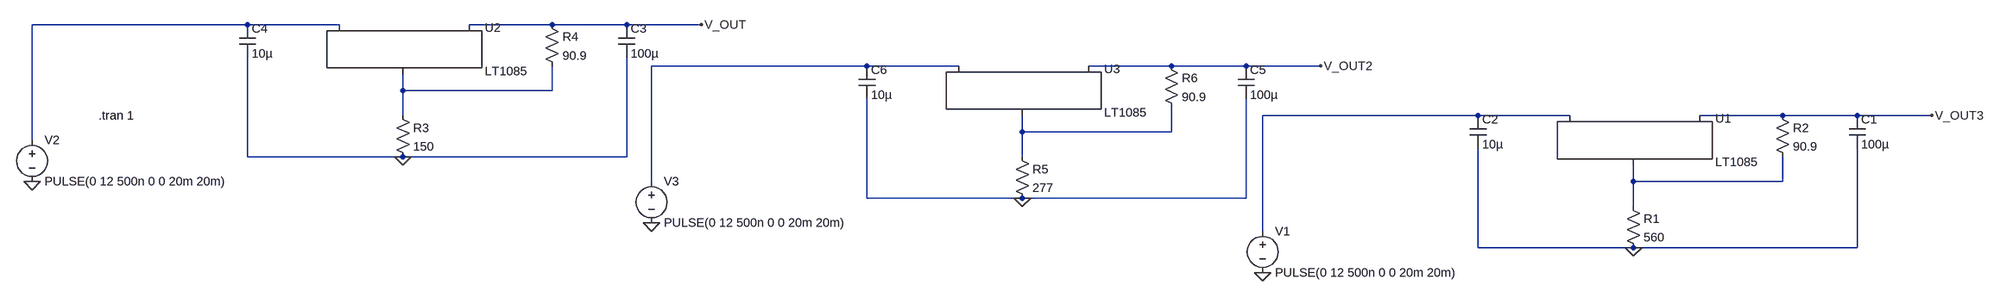
[diagram p0: schematic Component_Voltage_Generation_LT_Spice_Schematic.asc]
Component_Voltage_Generation_LT_Spice_Schematic.asc, the LTspice schematic file:
Version 4
SHEET 1 1040 820
WIRE -3072 80 -3488 80
WIRE -2880 80 -3072 80
WIRE -2464 80 -2624 80
WIRE -2320 80 -2464 80
WIRE -2176 80 -2320 80
WIRE -1856 160 -2272 160
WIRE -1664 160 -1856 160
WIRE -1248 160 -1408 160
WIRE -1104 160 -1248 160
WIRE -960 160 -1104 160
WIRE -2752 208 -2752 176
WIRE -2464 208 -2464 160
WIRE -2464 208 -2752 208
WIRE -2752 256 -2752 208
WIRE -656 256 -1072 256
WIRE -464 256 -656 256
WIRE -48 256 -208 256
WIRE 96 256 -48 256
WIRE 240 256 96 256
WIRE -1536 288 -1536 256
WIRE -1248 288 -1248 240
WIRE -1248 288 -1536 288
WIRE -3488 304 -3488 80
WIRE -3072 336 -3072 144
WIRE -2752 336 -3072 336
WIRE -2320 336 -2320 144
WIRE -2320 336 -2752 336
WIRE -1536 336 -1536 288
WIRE -2272 384 -2272 160
WIRE -336 384 -336 352
WIRE -48 384 -48 336
WIRE -48 384 -336 384
WIRE -1856 416 -1856 224
WIRE -1536 416 -1856 416
WIRE -1104 416 -1104 224
WIRE -1104 416 -1536 416
WIRE -336 432 -336 384
WIRE -1072 480 -1072 256
WIRE -656 512 -656 320
WIRE -336 512 -656 512
WIRE 96 512 96 320
WIRE 96 512 -336 512
FLAG -336 512 0
FLAG 240 256 V_OUT3
FLAG -2752 336 0
FLAG -2176 80 V_OUT
FLAG -3488 384 0
FLAG -1536 416 0
FLAG -960 160 V_OUT2
FLAG -2272 464 0
FLAG -1072 560 0
SYMBOL PowerProducts\\LT1085 -336 256 R0
SYMATTR InstName U1
SYMBOL voltage -1072 464 R0
WINDOW 123 0 0 Left 0
WINDOW 39 0 0 Left 0
SYMATTR InstName V1
SYMATTR Value PULSE(0 12 500n 0 0 20m 20m)
SYMBOL res -352 416 R0
SYMATTR InstName R1
SYMATTR Value 560
SYMBOL res -64 240 R0
SYMATTR InstName R2
SYMATTR Value 90.9
SYMBOL cap 80 256 R0
SYMATTR InstName C1
SYMATTR Value 100µ
SYMBOL cap -672 256 R0
SYMATTR InstName C2
SYMATTR Value 10µ
SYMBOL PowerProducts\\LT1085 -2752 80 R0
SYMATTR InstName U2
SYMBOL voltage -3488 288 R0
WINDOW 123 0 0 Left 0
WINDOW 39 0 0 Left 0
SYMATTR InstName V2
SYMATTR Value PULSE(0 12 500n 0 0 20m 20m)
SYMBOL res -2768 240 R0
SYMATTR InstName R3
SYMATTR Value 150
SYMBOL res -2480 64 R0
SYMATTR InstName R4
SYMATTR Value 90.9
SYMBOL cap -2336 80 R0
SYMATTR InstName C3
SYMATTR Value 100µ
SYMBOL cap -3088 80 R0
SYMATTR InstName C4
SYMATTR Value 10µ
SYMBOL PowerProducts\\LT1085 -1536 160 R0
SYMATTR InstName U3
SYMBOL voltage -2272 368 R0
WINDOW 123 0 0 Left 0
WINDOW 39 0 0 Left 0
SYMATTR InstName V3
SYMATTR Value PULSE(0 12 500n 0 0 20m 20m)
SYMBOL res -1552 320 R0
SYMATTR InstName R5
SYMATTR Value 277
SYMBOL res -1264 144 R0
SYMATTR InstName R6
SYMATTR Value 90.9
SYMBOL cap -1120 160 R0
SYMATTR InstName C5
SYMATTR Value 100µ
SYMBOL cap -1872 160 R0
SYMATTR InstName C6
SYMATTR Value 10µ
TEXT -3360 256 Left 2 !.tran 1

The netlist it stands for:
* Component_Voltage_Generation_LT_Spice_Schematic.asc
XU1 N006 V_OUT3 N004 LT1085
V1 N004 0 PULSE(0 12 500n 0 0 20m 20m)
R1 N006 0 560
R2 V_OUT3 N006 90.9
C1 V_OUT3 0 100µ
C2 N004 0 10µ
XU2 N003 V_OUT N001 LT1085
V2 N001 0 PULSE(0 12 500n 0 0 20m 20m)
R3 N003 0 150
R4 V_OUT N003 90.9
C3 V_OUT 0 100µ
C4 N001 0 10µ
XU3 N005 V_OUT2 N002 LT1085
V3 N002 0 PULSE(0 12 500n 0 0 20m 20m)
R5 N005 0 277
R6 V_OUT2 N005 90.9
C5 V_OUT2 0 100µ
C6 N002 0 10µ
.tran 1
.backanno
.end